# Altium schematic sheet TSC_AD7843_NEWLCD.SchDoc: TFT Touchscreen Interface
size A3; Organization: Altium Limited.; Address1: Level 3, 12a Rodborough Rd; Address2: Frenchs Forest 2086; Address3: NSW; Address4: AUSTRALIA; SheetNumber: 1; SheetTotal: 100
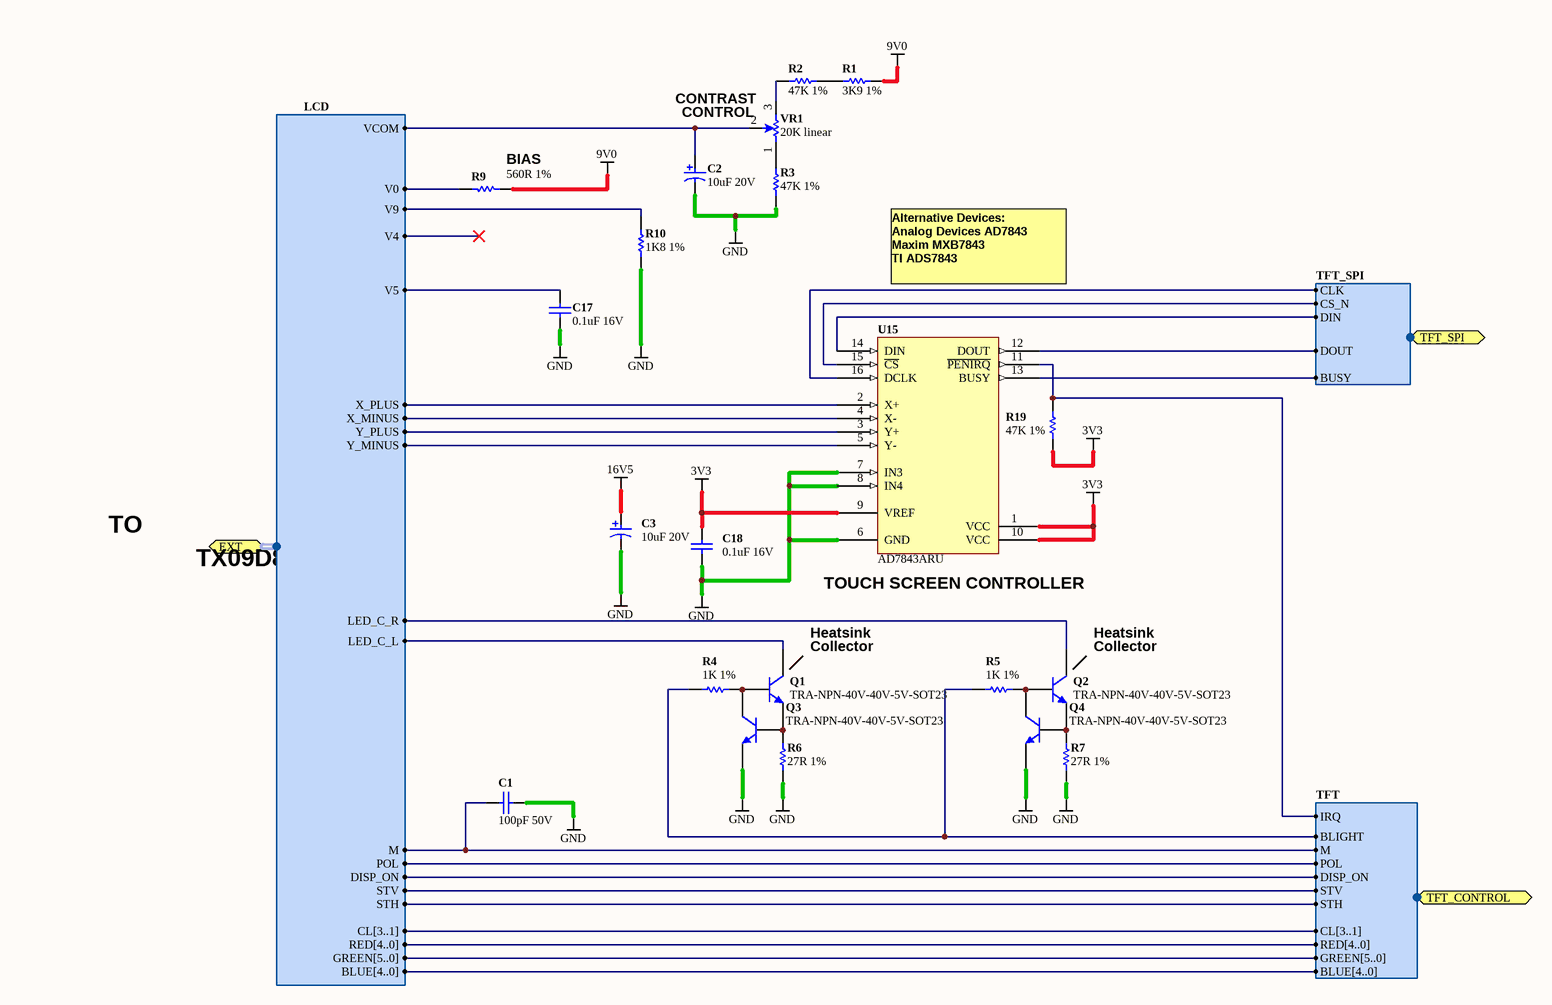
[diagram p0: TSC_AD7843_NEWLCD.SchDoc]

## Parts
C1  100pF 50V  [CAPC1005-STAR]
C2  10uF 20V  [CAPC3528-STAR]
C3  10uF 20V  [CAPC3528-STAR]
C17  0.1uF 16V  [CAPC1005-STAR]
C18  0.1uF 16V  [CAPC1005-STAR]
Q1  TRA-NPN-40V-40V-5V-SOT23  [SOT95P230-3C]
Q2  TRA-NPN-40V-40V-5V-SOT23  [SOT95P230-3C]
Q3  TRA-NPN-40V-40V-5V-SOT23  [SOT95P230-3C]
Q4  TRA-NPN-40V-40V-5V-SOT23  [SOT95P230-3C]
R1  3K9 1%  [RESC1005-STAR]
R2  47K 1%  [RESC1005-STAR]
R3  47K 1%  [RESC1005-STAR]
R4  1K 1%  [RESC1005-STAR]
R5  1K 1%  [RESC1005-STAR]
R6  27R 1%  [RESC1005-STAR]
R7  27R 1%  [RESC1005-STAR]
R9  560R 1%  [RESC1005-STAR]
R10  1K8 1%  [RESC1005-STAR]
R19  47K 1%  [RESC1005-STAR]
U15  AD7843ARU  [TSOP65P638-16]
VR1  20K linear  [TRIM_3314J-1-203E]

## Ports
EXT (harness LCD), TFT_CONTROL (harness TFT), TFT_SPI (harness TFT_SPI)

## Harnesses
LCD: CL[3..1], RED[4..0], BLUE[4..0], M, DISP_ON, STV, STH, POL, Y_PLUS, X_MINUS, Y_MINUS, X_PLUS, GREEN[5..0], LED_C_L, LED_C_R, VCOM, V0, V4, V5, V9
TFT: IRQ, BLIGHT, M, POL, DISP_ON, STV, STH, CL[3..1], RED[4..0], GREEN[5..0], BLUE[4..0]
TFT_SPI: CLK, CS_N, DIN, DOUT, BUSY

## Nets
3V3: C18.1 R19.2 U15.1(VCC) U15.9(VREF) U15.10(VCC)
9V0: R1.2 R9.2
16V5: C3.1
GND: C1.2 C2.2 C3.2 C17.2 C18.2 Q3.2(E) Q4.2(E) R3.1 R6.1 R7.1 R10.1 U15.6(GND) U15.7(IN3) U15.8(IN4)
NetC1_1: C1.1 ; port EXT.M, port TFT_CONTROL.M
NetC2_1: C2.1 VR1.2 ; port EXT.VCOM
NetC17_1: C17.1 ; port EXT.V5
NetQ1_1: Q1.1(B) Q3.3(C) R4.2
NetQ1_2: Q1.2(E) Q3.1(B) R6.2
NetQ1_3: Q1.3(C) ; port EXT.LED_C_L
NetQ2_1: Q2.1(B) Q4.3(C) R5.2
NetQ2_2: Q2.2(E) Q4.1(B) R7.2
NetQ2_3: Q2.3(C) ; port EXT.LED_C_R
NetR1_1: R1.1 R2.2
NetR2_1: R2.1 VR1.3
NetR3_2: R3.2 VR1.1
NetR4_1: R4.1 R5.1 ; port TFT_CONTROL.BLIGHT
NetR9_1: R9.1 ; port EXT.V0
NetR10_2: R10.2 ; port EXT.V9
NetR19_1: R19.1 U15.11(~{PENIRQ}) ; port TFT_CONTROL.IRQ
NetU15_2: U15.2(X+) ; port EXT.X_PLUS
NetU15_3: U15.3(Y+) ; port EXT.Y_PLUS
NetU15_4: U15.4(X-) ; port EXT.X_MINUS
NetU15_5: U15.5(Y-) ; port EXT.Y_MINUS
NetU15_12: U15.12(DOUT) ; port TFT_SPI.DOUT
NetU15_13: U15.13(BUSY) ; port TFT_SPI.BUSY
NetU15_14: U15.14(DIN) ; port TFT_SPI.DIN
NetU15_15: U15.15(~{CS}) ; port TFT_SPI.CS_N
NetU15_16: U15.16(DCLK) ; port TFT_SPI.CLK
(unnamed): port EXT.DISP_ON, port TFT_CONTROL.DISP_ON
(unnamed): port EXT.STV, port TFT_CONTROL.STV
(unnamed): port EXT.STH, port TFT_CONTROL.STH
(unnamed): port EXT.POL, port TFT_CONTROL.POL

## Notes on the sheet
- (near VR1) CONTRAST
- (near R9) BIAS
- CONTROL
- Alternative Devices:
  Analog Devices AD7843
  Maxim MXB7843
  TI ADS7843
- TO
- TX09D80VM1CEA
- (near Q1) Heatsink
- (near U15) TOUCH SCREEN CONTROLLER
- (near Q2) Heatsink
- (near Q1) Collector
- (near Q2) Collector
- Sheet Title
- Project Title
- Size:
- Date:
- A3
- Assy:
- Time:
- Revision:
- Sheet
- of
- File:

## Library data of the parts
C1 = D-101-0078: Capacitor, Ceramic, 100pF 5% 50V 0402 (1005) COG; Polarity: Non-Polarized; Category: Capacitor; Capacitance: 100 pF; Dielectric: COG; Mounting Technology: Surface Mount; Rated Voltage: 50 V; Status: Production; Technology: Ceramic; Tolerance: 5 %
C2 C3 = D-101-0007: Capacitor, Tantalum, 10uF 10% 20V MCCT-B (3528); Polarity: Polarized; Category: Capacitor; Capacitance: 10 uF; Mounting Technology: Surface Mount; Rated Voltage: 20 V; Status: Production; Technology: Tantalum; Tolerance: 10 %
C17 C18 = D-101-0080: Capacitor, Ceramic, 0.1uF 10% 16V 0402 (1005) X7R; Polarity: Non-Polarized; Category: Capacitor; Capacitance: 0.1 uF; Dielectric: X7R; Mounting Technology: Surface Mount; Rated Voltage: 16 V; Status: Production; Technology: Ceramic; Tolerance: 10 %
Q1-Q4 = D-152-0001: Transistor, FMMT491A Small Signal NPN; Category: Transistor-Bipolar; Mounting Technology: Surface Mount; Status: Production; Transistor Type: NPN
R1 = D-100-0097: Resistor, 3K9 1% 0402 (1005); Power Rating: 63 mW; Resistance: 3.9 K; Category: Resistor; Mounting Technology: Surface Mount; Status: Production; Tolerance: 1 %
R2 R3 R19 = D-100-0092: Resistor, 47K 1% 0402 (1005); Power Rating: 63 mW; Category: Resistor; Mounting Technology: Surface Mount; Resistance: 47 K; Status: Production; Tolerance: 1 %
R4 R5 = D-100-0121: Resistor, 1K 1% 0402 (1005); Power Rating: 63 mW; Category: Resistor; Mounting Technology: Surface Mount; Resistance: 1 K; Status: Production; Tolerance: 1 %
R6 R7 = D-100-0108: Resistor, 27R 1% 0402 (1005); Power Rating: 63 mW; Category: Resistor; Mounting Technology: Surface Mount; Resistance: 27 R; Status: Production; Tolerance: 1 %
R9 = D-100-0008: Resistor, 560R 1% 0402 (1005); Power Rating: 63 mW; Category: Resistor; Mounting Technology: Surface Mount; Resistance: 560 R; Status: Production; Tolerance: 1 %
R10 = D-100-0162: Resistor, 1K8 1% 0402 (1005); Power Rating: 63 mW; Resistance: 1.8 K; Category: Resistor; Mounting Technology: Surface Mount; Status: Unreleased; Tolerance: 1 %
U15 = D-202-0001: AD7843ARU,12-bit SPI Touch Screen Digitizer; Supply Voltage: mV; Category: IC-Video; Mounting Technology: Surface Mount; Status: Production
VR1 = D-105-0000: Potentiometer, 20K 4mm Cermet PCB SMT Trimmer; Category: Potentiometer; Status: Production